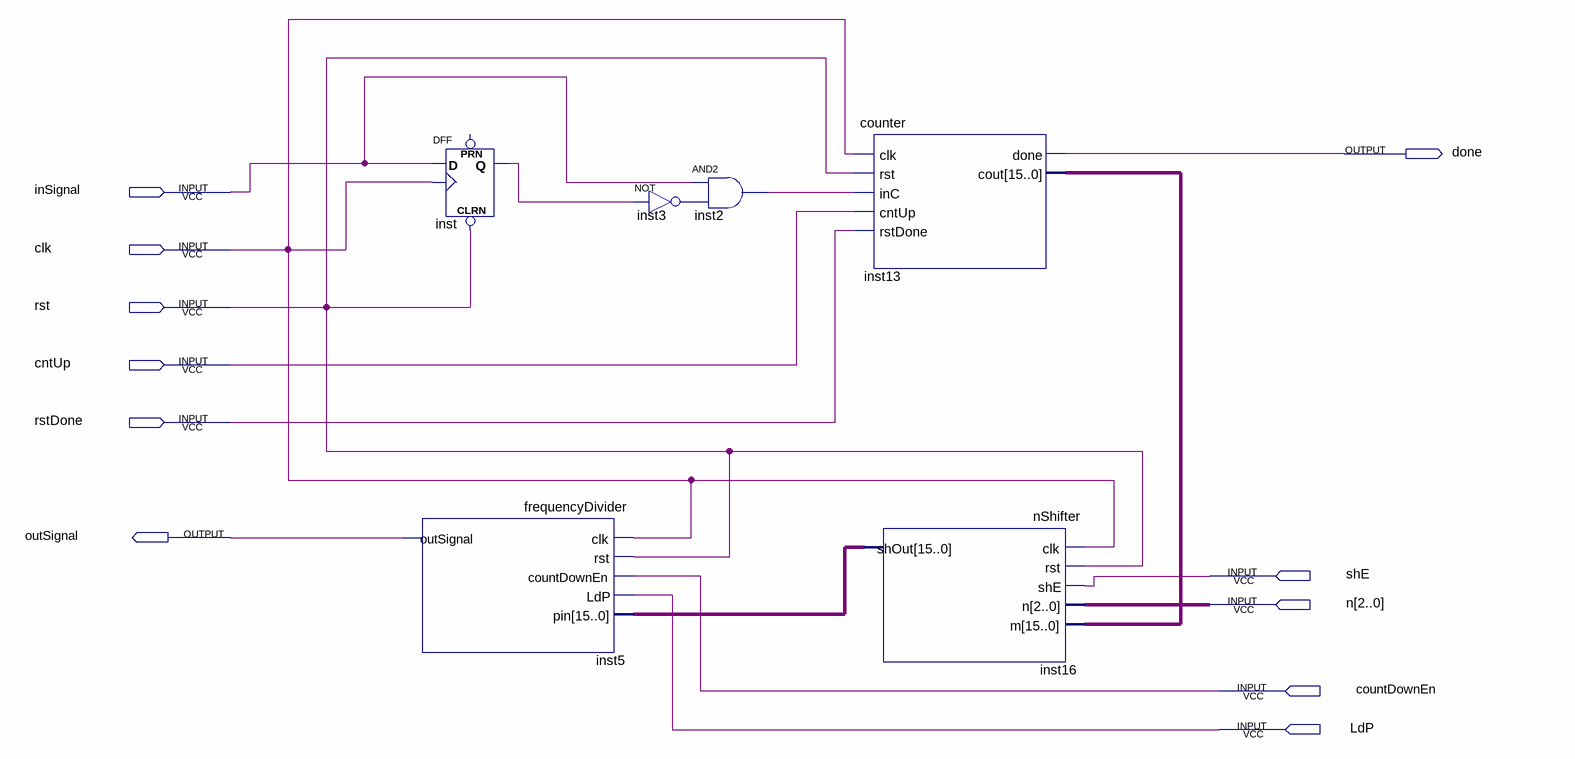
[diagram p0: schematic sheet]
// Quartus schematic CA5.bdf as structural Verilog: 6 symbols, 11 pins
module CA5 (
  input  inSignal,
  input  clk,
  input  rst,
  input  cntUp,
  input  rstDone,
  input  shE,
  input  [2:0] n,
  input  countDownEn,
  input  LdP,
  output done,
  output outSignal
);

  wire inst2_out, inst3_out, inst_q;
  wire [15:0] inst13_cout, inst16_shout;

  DFF inst (.CLRN(rst), .CLK(clk), .D(inSignal), .Q(inst_q));  // open: PRN
  frequencyDivider inst5 (
    .clk(clk), .rst(rst), .countDownEn(countDownEn), .LdP(LdP), .pin(inst16_shout), .outSignal(outSignal));
  not inst3 (inst3_out, inst_q);
  and inst2 (inst2_out, inSignal, inst3_out);
  counter inst13 (
    .clk(clk), .rst(rst), .inC(inst2_out), .cntUp(cntUp), .rstDone(rstDone), .done(done), .cout(inst13_cout));
  nShifter inst16 (.clk(clk), .rst(rst), .shE(shE), .n(n), .m(inst13_cout), .shOut(inst16_shout));
endmodule
